# EAGLE schematic bubble size sensor (EAGLE 7.3.0)
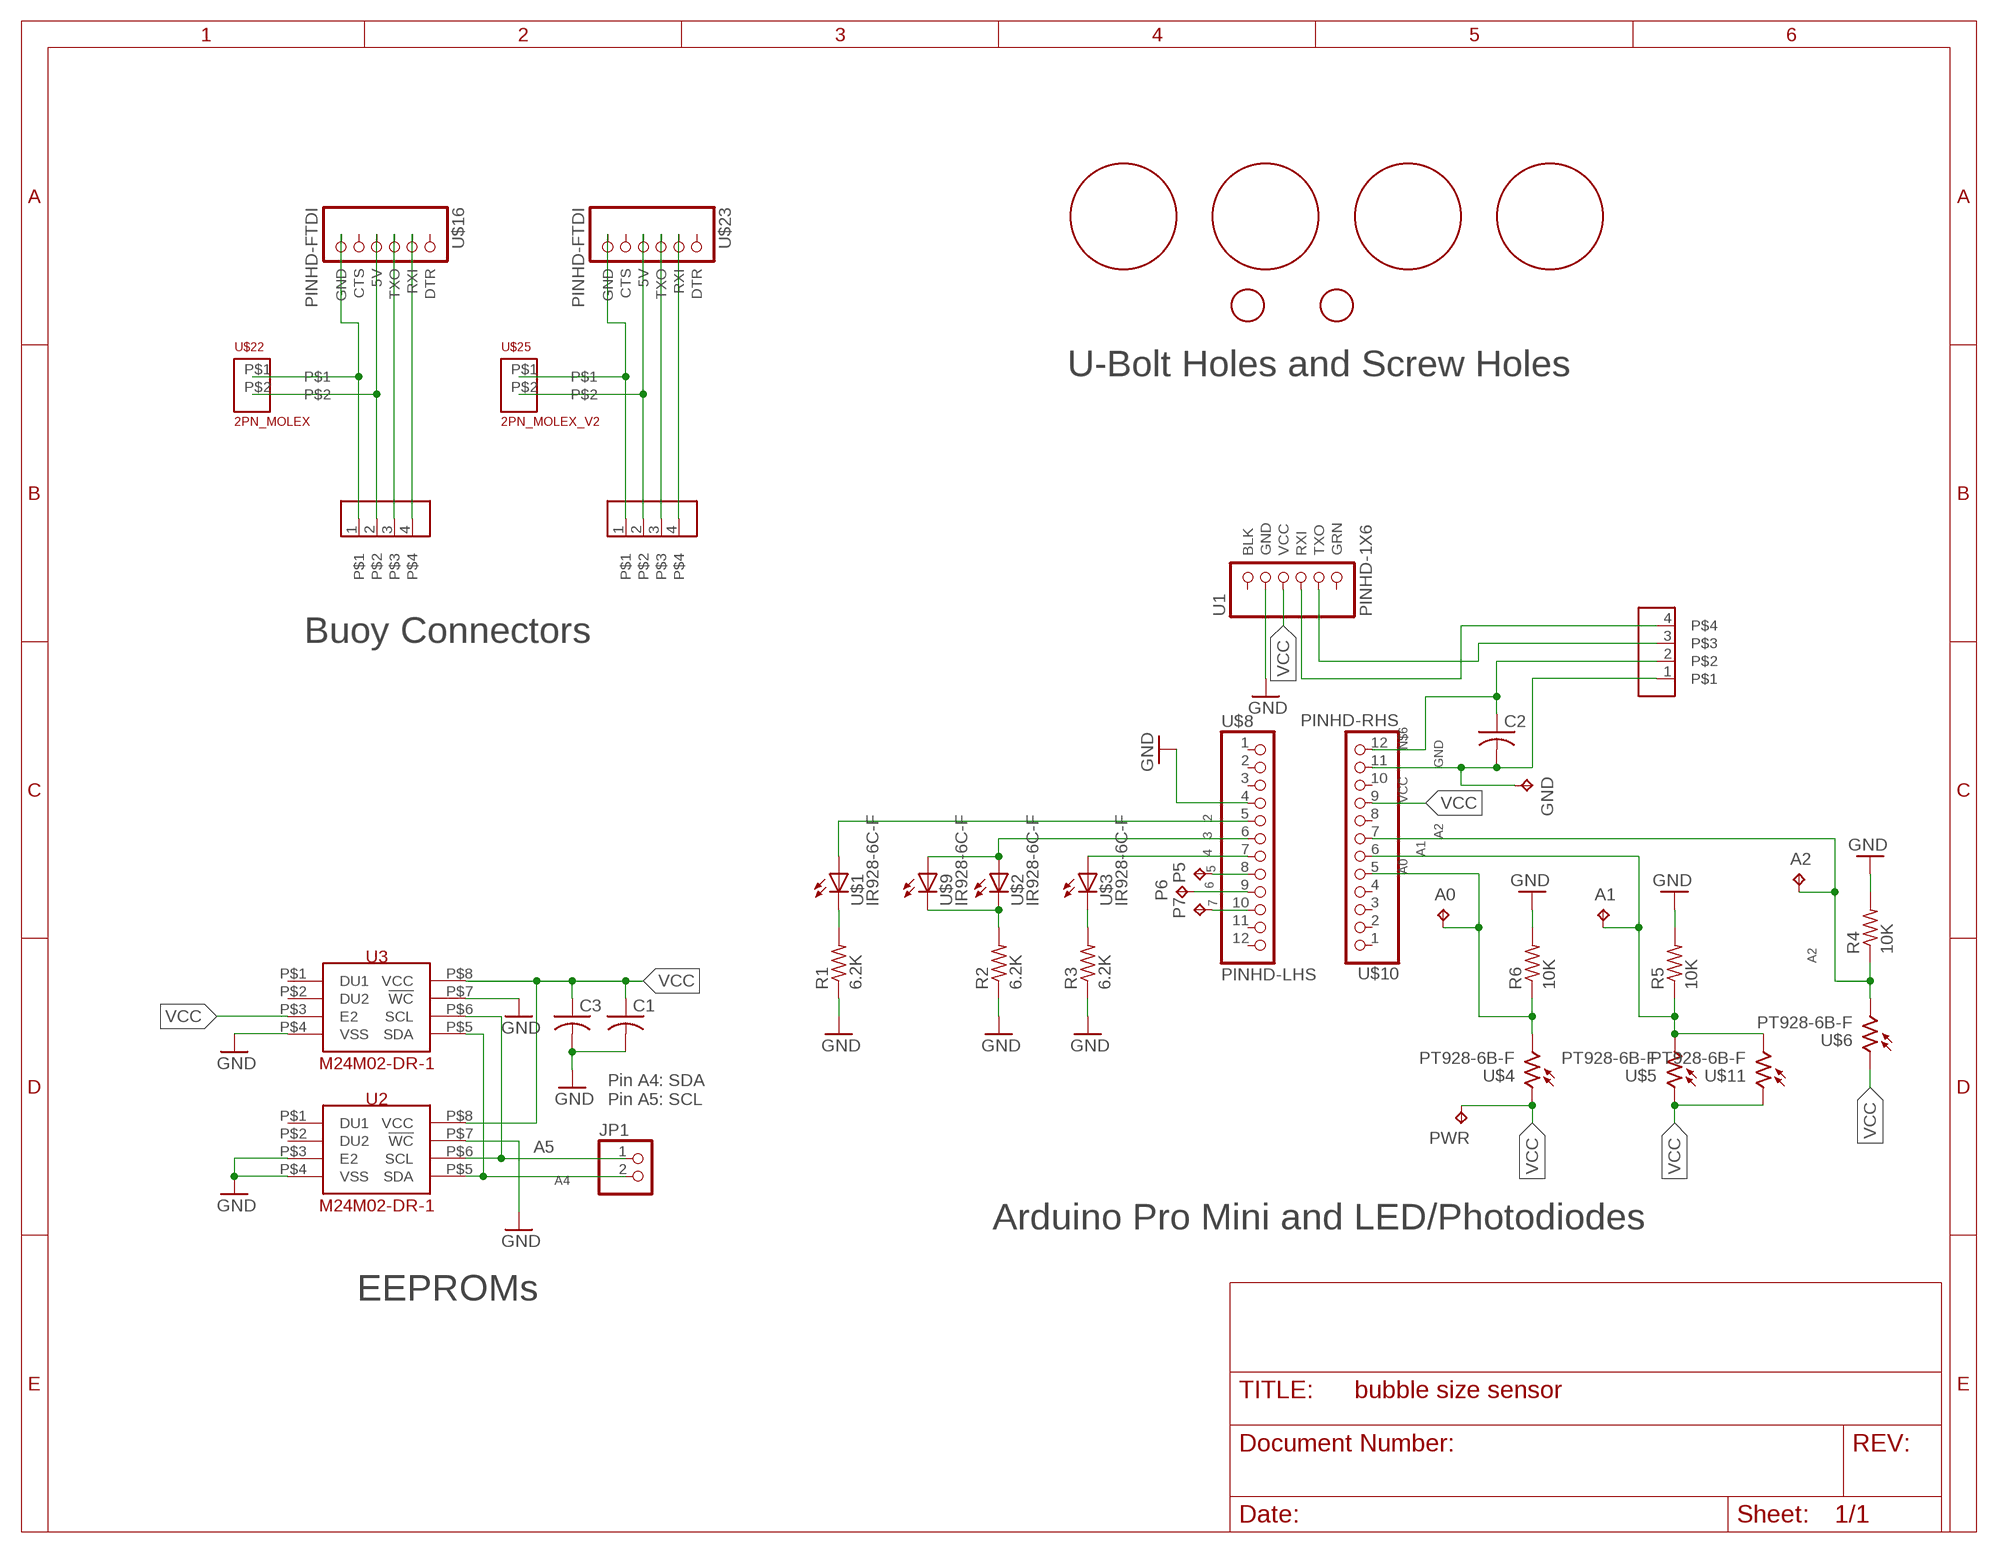
[diagram p0: schematic, sheet 1]

## Parts
A0  TPPAD1-13  [P1-13]
A1  TPPAD1-13  [P1-13]
A2  TPPAD1-13  [P1-13]
C1  C-USC0603  [C0603]
C2  C-USC1210  [C1210]
C3  C-USC0603  [C0603]
GND  TPPAD1-13  [P1-13]
H$13  M2_SCREW_HOLE  [M2_SCREW_HOLE]
H$15  M2_SCREW_HOLE  [M2_SCREW_HOLE]
H$17  UBOLT_HOLE  [UBOLT_HOLE]
H$18  UBOLT_HOLE  [UBOLT_HOLE]
H$19  UBOLT_HOLE  [UBOLT_HOLE]
H$20  UBOLT_HOLE  [UBOLT_HOLE]
JP1  PINHD-1X2  [1X02]
P5  TPPAD1-13  [P1-13]
P6  TPPAD1-13  [P1-13]
P7  TPPAD1-13  [P1-13]
PWR  TPPAD1-13  [P1-13]
R1  6.2K  R-US_R0603  [R0603]
R2  6.2K  R-US_R0603  [R0603]
R3  6.2K  R-US_R0603  [R0603]
R4  10K  R-US_R0603  [R0603]
R5  10K  R-US_R0603  [R0603]
R6  10K  R-US_R0603  [R0603]
U1  PINHD-1X6  [1X6]
U2  M24M02-DR-1  [SO8N]
U3  M24M02-DR-1  [SO8N]
U$1  IR928-6C-F  [LED_LAYOUT]
U$2  IR928-6C-F  [LED_LAYOUT]
U$3  IR928-6C-F  [LED_LAYOUT]
U$4  PT928-6B-F  [LED_LAYOUT]
U$5  PT928-6B-F  [LED_LAYOUT]
U$6  PT928-6B-F  [LED_LAYOUT]
U$8  PINHD-LHS  [1X12]
U$9  IR928-6C-F  [LED_LAYOUT]
U$10  PINHD-RHS  [1X12]
U$11  PT928-6B-F  [LED_LAYOUT]
U$14  MICROFIT3.0_4POS_SMD  [MICRO_FIT3.0_4POS-SM]
U$16  PINHD-FTDI  [1X6]
U$21  MICROFIT3.0_4POS_SMD  [MICRO_FIT3.0_4POS-SM]
U$22  2PN_MOLEX  [2PN_MOLEX]
U$23  PINHD-FTDI  [1X6]
U$24  MICROFIT3.0_4POS_SMD  [MICRO_FIT3.0_4POS-SM]
U$25  2PN_MOLEX_V2  [2PN_MOLEX_V2]

## Nets
2: U$1.PWR U$8.5
3: U$2.PWR U$8.6 U$9.PWR
4: U$3.PWR U$8.7
5: P5.TP U$8.8
6: P6.TP U$8.9
7: P7.TP U$8.10
A0: A0.TP R6.1 U$4.RSTR U$10.5(A3)
A1: A1.TP R5.1 U$5.RSTR U$10.6(A2) U$11.RSTR
A2: A2.TP R4.1 U$6.RSTR U$10.7(A1)
A4: JP1.2 U2.P$5(SDA) U3.P$5(SDA)
A5: JP1.1 U2.P$6(SCL) U3.P$6(SCL)
GND: C1.2 C2.2 C3.2 GND.TP R1.1 R2.1 R3.1 R4.2 R5.2 R6.2 U1.2(GND) U2.P$3(E2) U2.P$4(VSS) U2.P$7(!WC) U3.P$4(VSS) U3.P$7(!WC) U$8.4(GND) U$10.11 U$14.1
GND2: U$16.6(GND) U$21.1 U$22.P$1
GND3: U$23.6(GND) U$24.1 U$25.P$1
N$1: R1.2 U$1.RSTR
N$2: R2.2 U$2.RSTR U$9.RSTR
N$3: R3.2 U$3.RSTR
N$4: U$23.4(5V) U$24.2 U$25.P$2
N$5: U1.4(RXI) U$14.4
N$6: C2.1 U$10.12 U$14.2
N$7: U1.5(TXO) U$14.3
N$8: U$16.4(5V) U$21.2 U$22.P$2
N$9: U$16.2(RXI) U$21.4
N$10: U$16.3(TXO) U$21.3
N$11: U$23.2(RXI) U$24.4
N$12: U$23.3(TXO) U$24.3
VCC: C1.1 C3.1 PWR.TP U1.3(VCC) U2.P$8(VCC) U3.P$3(E2) U3.P$8(VCC) U$4.PWR U$5.PWR U$6.PWR U$10.9 U$11.PWR
Unconnected: U1.1(BLK) U1.6(GRN) U2.P$1(DU1) U2.P$2(DU2) U3.P$1(DU1) U3.P$2(DU2) U$8.1(TXO) U$8.2(RXI) U$8.3(RST) U$8.11 U$8.12 U$10.1(RAW) U$10.2(GND2) U$10.3(RST) U$10.4(VCC) U$10.8(A0) U$10.10 U$16.1(DTR) U$16.5(CTS) U$23.1(DTR) U$23.5(CTS)

## Notes on the sheet
- U-Bolt Holes and Screw Holes
- Buoy Connectors
- Pin A4: SDA
  Pin A5: SCL
- Arduino Pro Mini and LED/Photodiodes
- EEPROMs

## Library data of the parts
A0 A1 A2 GND P5-P7 PWR = testpad:TP: Test pad
C1-C3 = rcl:C-US: CAPACITOR, American symbol
H$13 H$15 = kyle:M2_SCREW_HOLE
H$17-H$20 = kyle:UBOLT_HOLE: Hole designed for u-bolt used on bubble sizer
JP1 = kyle:PINHD-1X2: PIN HEADER
R1-R6 = resistor:R-US_: RESISTOR, American symbol
U1 = kyle:PINHD-1X6
U2 U3 = Schuyler:M24M02-DR: M24M02-DR 2 Megabit EEPROM.; MANPARTNUMBER: M24M02-DRMN6TP; MANUFACTURER: STMicroelectronics; PARTNUMBER: 497-11600-1-ND; SUPPLIER: Digikey
U$1-U$3 U$9 = kyle:IR928-6C-F: Digikey side-facing LED IR928-6C-F
U$4-U$6 U$11 = kyle:PT928-6B-F
U$8 = kyle:PINHD-LHS
U$10 = kyle:PINHD-RHS
U$14 U$21 U$24 = kyle:MICROFIT3.0_4POS_SMD: Molex Microfit 3.0 4 position connector, surface mount, NOT TESTED YET
U$16 U$23 = kyle:PINHD-FTDI: Header for Sparkfun's FTDI breakout board
U$22 = kyle:2PN_MOLEX
U$25 = kyle:2PN_MOLEX_V2

## Net classes
0 default: width 0.203 mm, drill 0.508 mm, clearance 0.254 mm